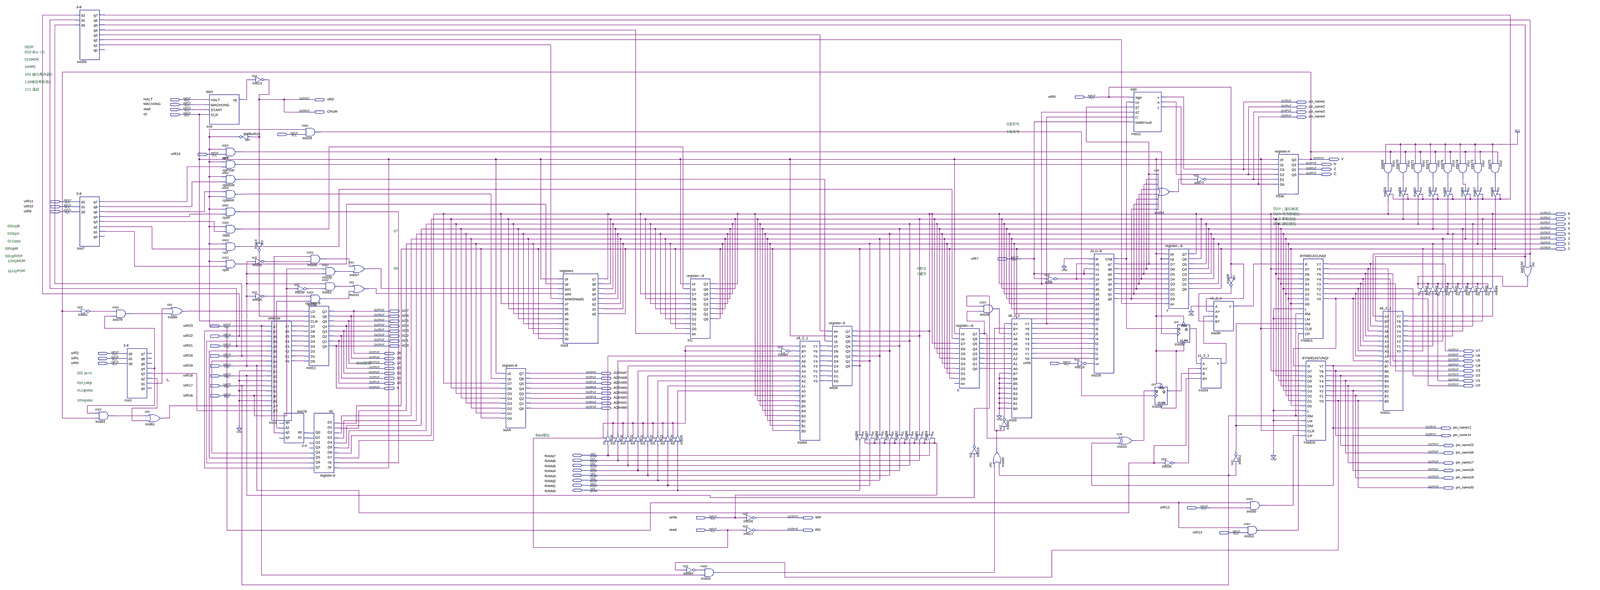
[diagram p0: schematic sheet, whole]
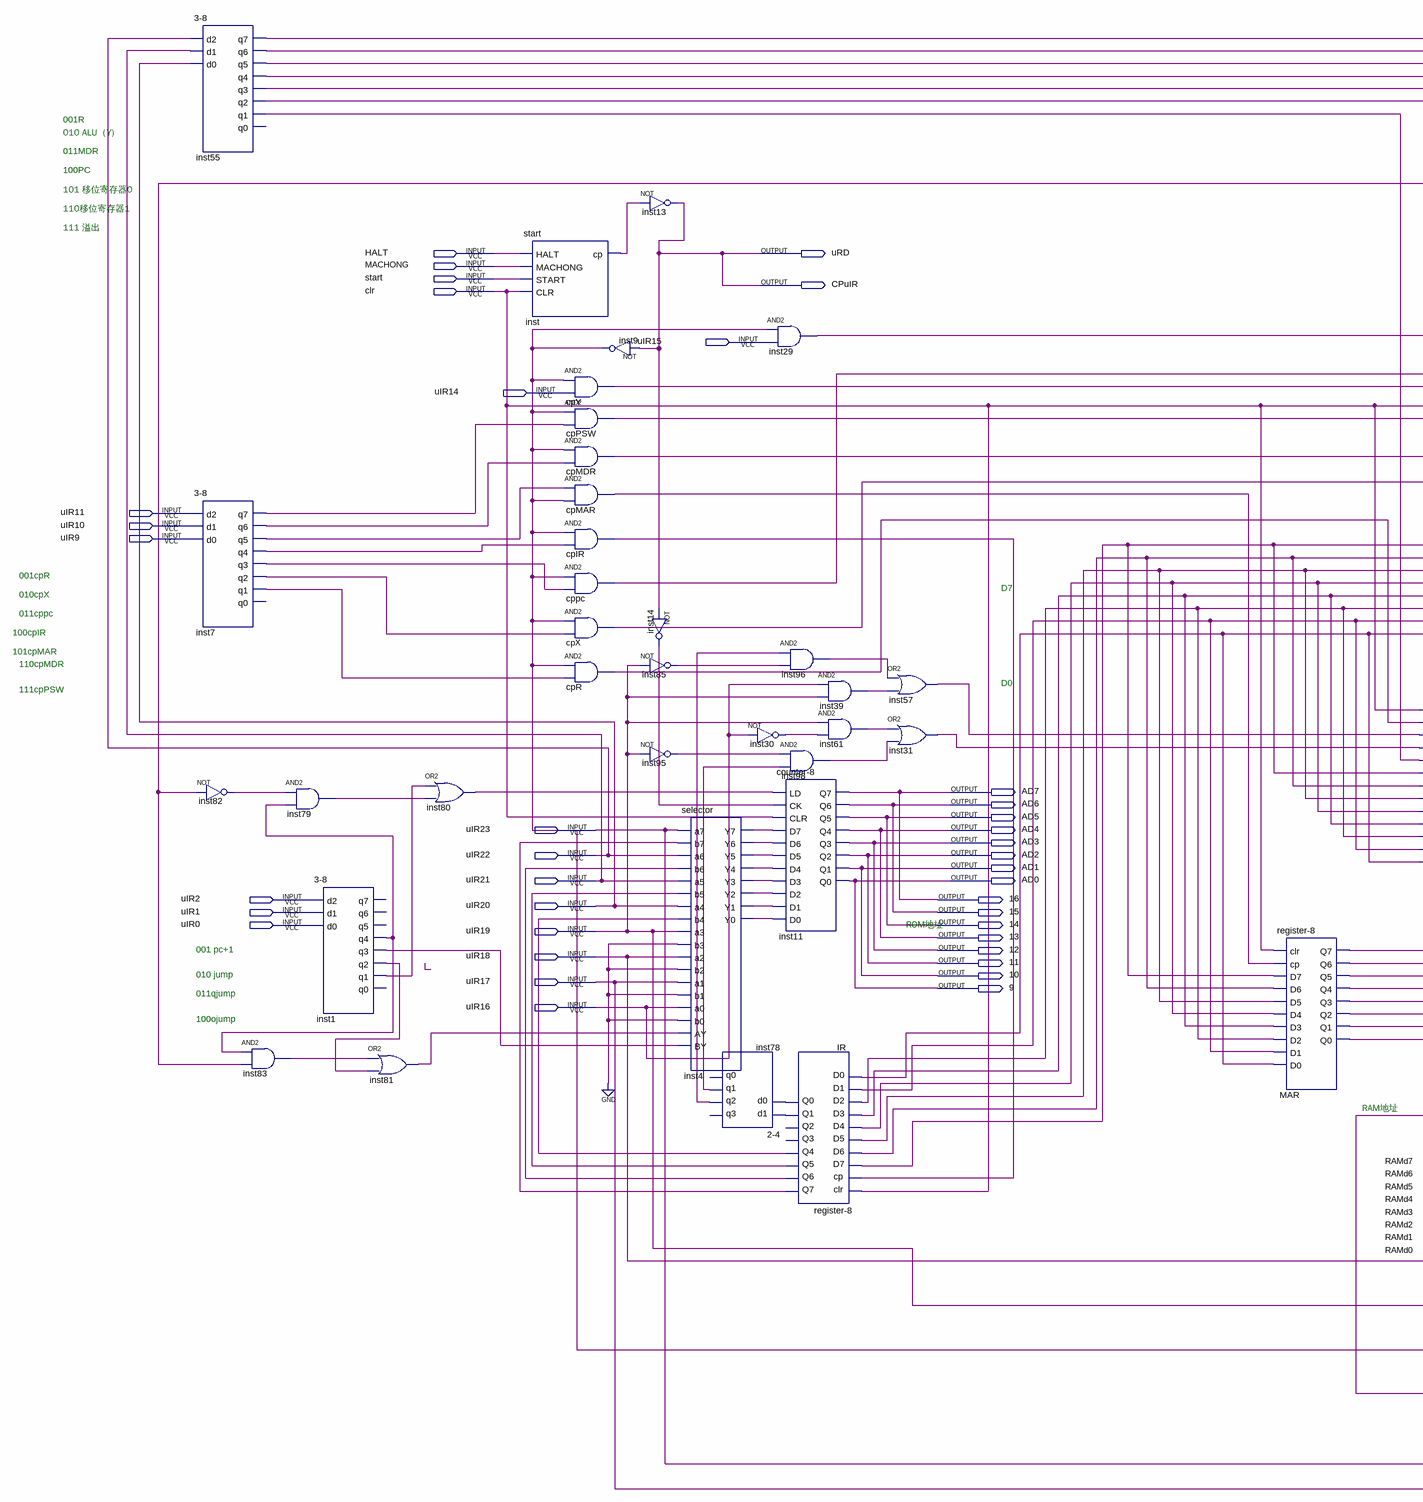
[diagram p1: schematic sheet, left part]
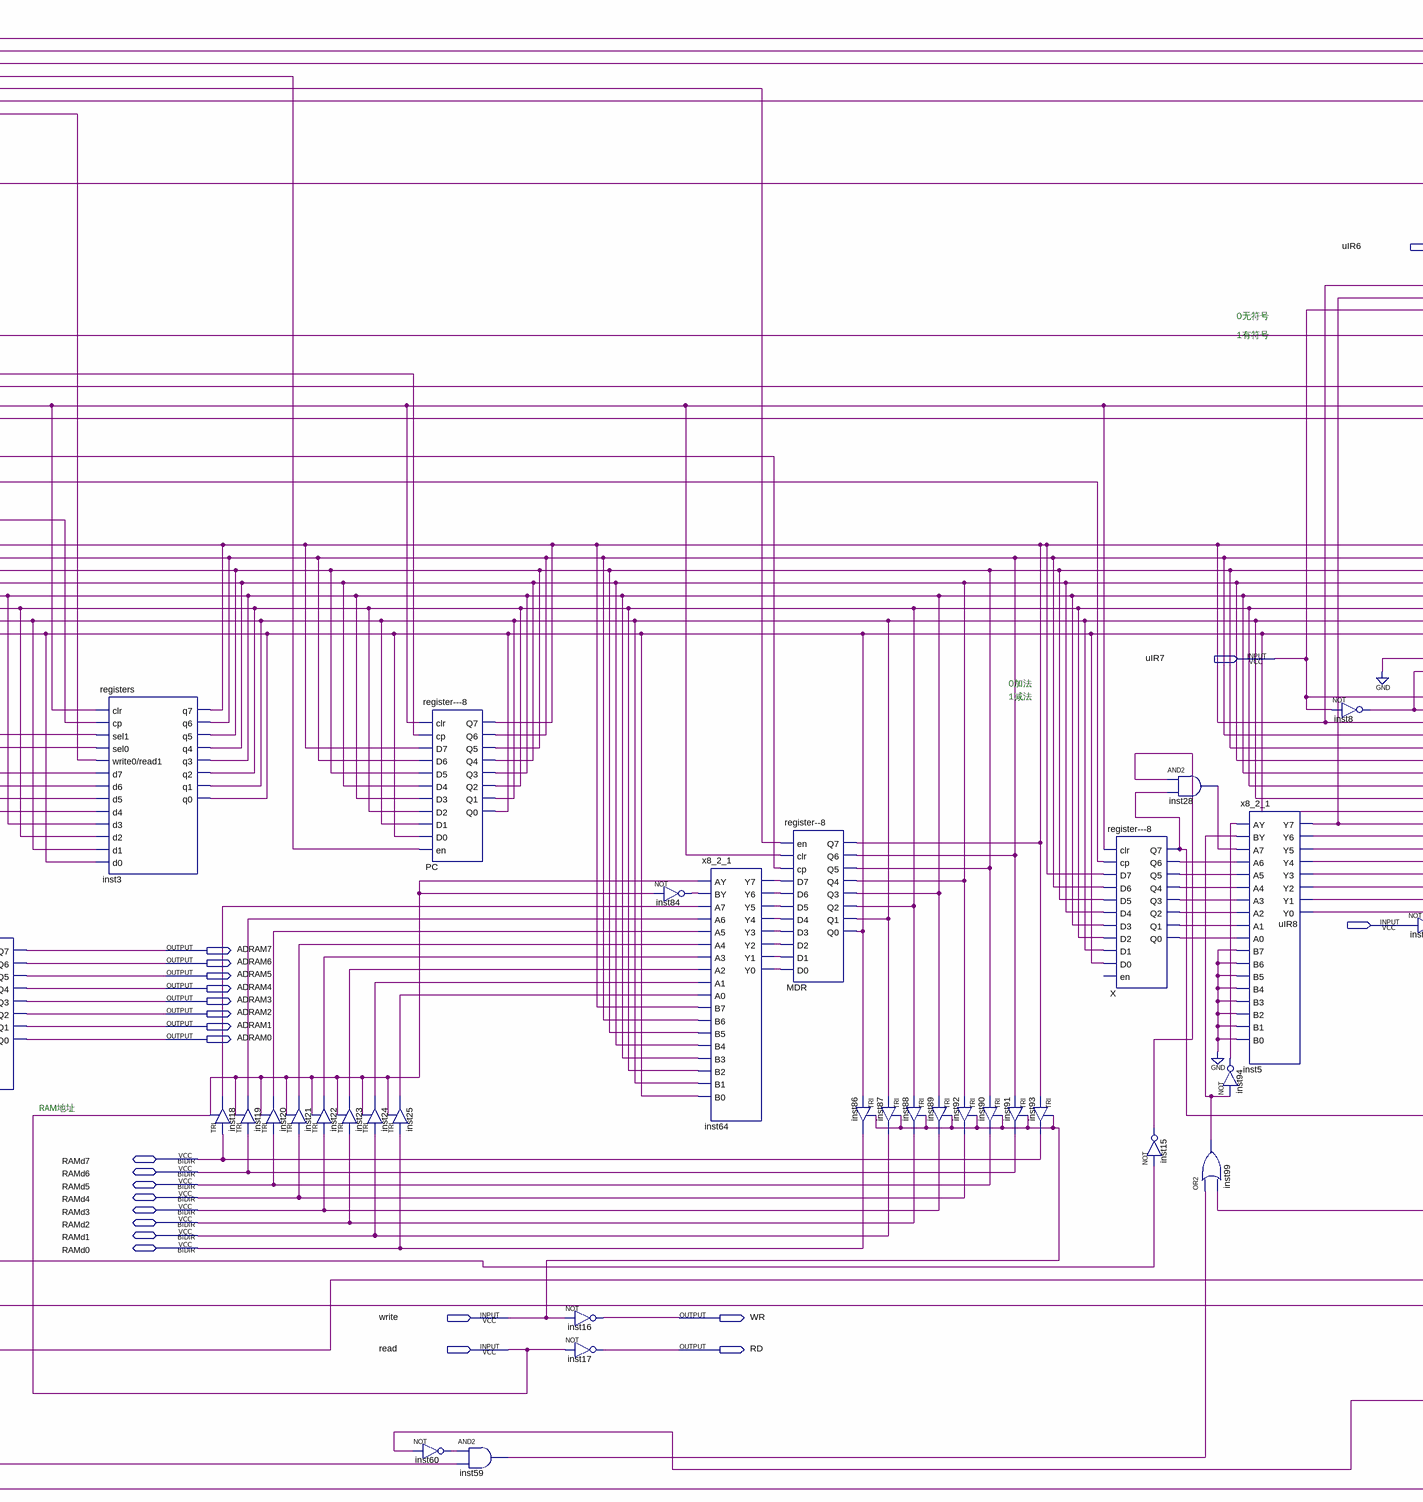
[diagram p2: schematic sheet, centre part]
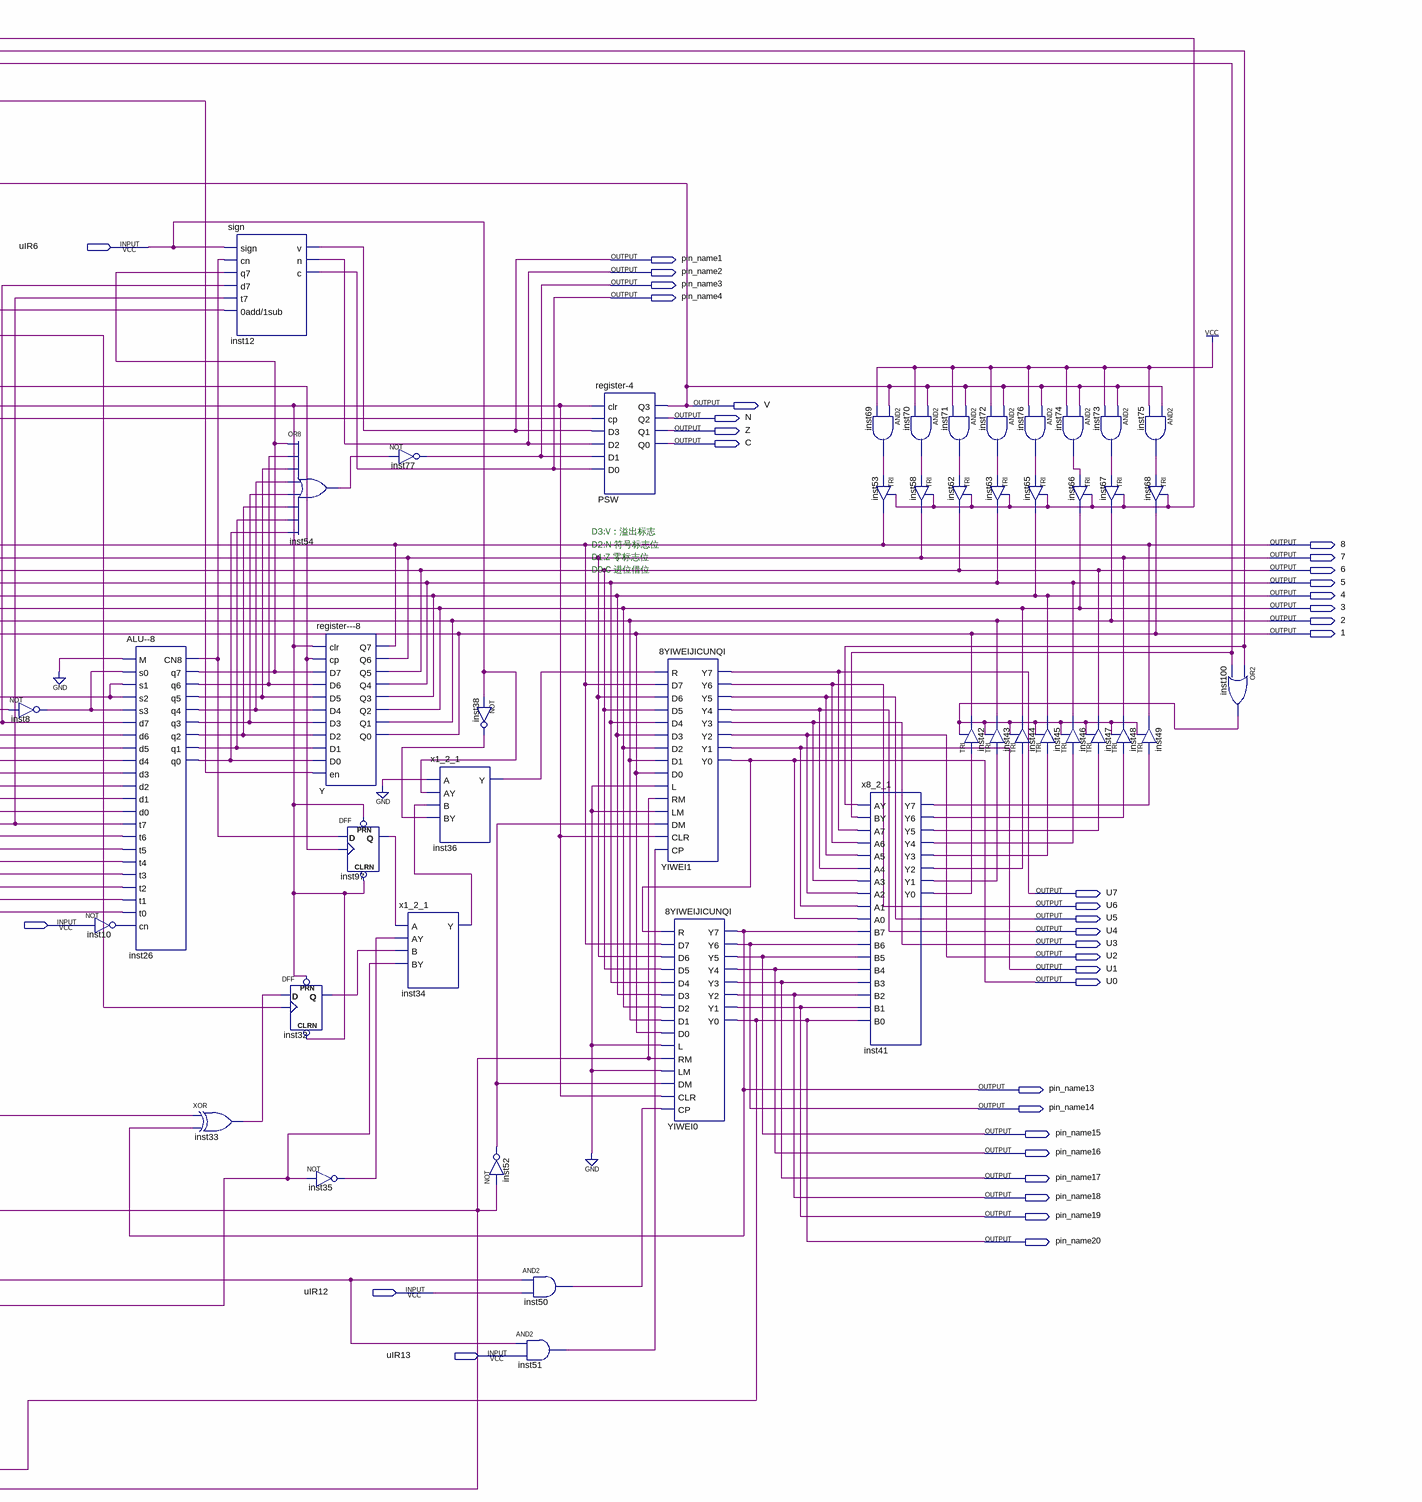
[diagram p3: schematic sheet, right part]
// Quartus schematic complete_machine.bdf as structural Verilog: 112 symbols, 95 pins
module complete_machine (
  input  uIR6,
  input  HALT,
  input  MACHONG,
  input  start,
  input  clr,
  input  uIR15,
  input  uIR14,
  input  uIR11,
  input  uIR10,
  input  uIR9,
  input  uIR7,
  input  uIR23,
  input  uIR22,
  input  uIR21,
  input  uIR2,
  input  uIR20,
  input  uIR1,
  input  uIR0,
  input  uIR8,
  input  uIR19,
  input  uIR18,
  input  uIR17,
  input  uIR16,
  input  uIR12,
  input  write,
  input  read,
  input  uIR13,
  inout  RAMd7,
  inout  RAMd6,
  inout  RAMd5,
  inout  RAMd4,
  inout  RAMd3,
  inout  RAMd2,
  inout  RAMd1,
  inout  RAMd0,
  output uRD,
  output pin_name1,
  output pin_name2,
  output CPuIR,
  output pin_name3,
  output pin_name4,
  output V,
  output N,
  output Z,
  output C,
  output \8 ,
  output \7 ,
  output \6 ,
  output \5 ,
  output \4 ,
  output \3 ,
  output \2 ,
  output \1 ,
  output AD7,
  output AD6,
  output AD5,
  output AD4,
  output AD3,
  output AD2,
  output AD1,
  output AD0,
  output U7,
  output \16 ,
  output U6,
  output \15 ,
  output U5,
  output \14 ,
  output U4,
  output \13 ,
  output U3,
  output \12 ,
  output ADRAM7,
  output U2,
  output \11 ,
  output ADRAM6,
  output U1,
  output \10 ,
  output ADRAM5,
  output U0,
  output \9 ,
  output ADRAM4,
  output ADRAM3,
  output ADRAM2,
  output ADRAM1,
  output ADRAM0,
  output pin_name13,
  output pin_name14,
  output pin_name15,
  output pin_name16,
  output pin_name17,
  output pin_name18,
  output pin_name19,
  output pin_name20,
  output WR,
  output RD
);

  wire cpIR_out, cpMAR_out, cpMDR_out, cppc_out, cpPSW_out, cpR_out, cpX_out, cpY_out, inst1_q1, inst1_q2,
       inst1_q3, inst1_q4, inst4_y0, inst4_y1, inst4_y2, inst4_y3, inst4_y4, inst4_y5, inst4_y6, inst4_y7,
       inst5_y0, inst5_y1, inst5_y2, inst5_y3, inst5_y4, inst5_y5, inst5_y6, inst5_y7, inst7_q1, inst7_q2,
       inst7_q3, inst7_q4, inst7_q5, inst7_q6, inst7_q7, inst8_out, inst9_out, inst10_out, inst14_out,
       inst15_out, inst18_out, inst19_out, inst20_out, inst21_out, inst22_out, inst23_out, inst24_out,
       inst25_out, inst26_cn8, inst26_q0, inst26_q1, inst26_q2, inst26_q3, inst26_q4, inst26_q5, inst26_q6,
       inst26_q7, inst28_out, inst29_out, inst30_out, inst31_out, inst32_q, inst33_out, inst34_y, inst35_out,
       inst36_y, inst38_out, inst39_out, inst41_y0, inst41_y1, inst41_y2, inst41_y3, inst41_y4, inst41_y5,
       inst41_y6, inst41_y7, inst50_out, inst51_out, inst52_out, inst54_out, inst55_q1, inst55_q2, inst55_q3,
       inst55_q4, inst55_q5, inst55_q6, inst55_q7, inst57_out, inst59_out, inst60_out, inst61_out, inst64_y0,
       inst64_y1, inst64_y2, inst64_y3, inst64_y4, inst64_y5, inst64_y6, inst64_y7, inst69_out, inst70_out,
       inst71_out, inst72_out, inst73_out, inst74_out, inst75_out, inst76_out, inst78_q1, inst78_q2,
       inst79_out, inst80_out, inst81_out, inst82_out, inst83_out, inst84_out, inst85_out, inst94_out,
       inst95_out, inst96_out, inst97_q, inst98_out, inst99_out, inst100_out, inst_cp, IR_q0, IR_q1, IR_q4,
       IR_q5, IR_q6, IR_q7, X_q0, X_q1, X_q2, X_q3, X_q4, X_q5, X_q6, X_q7;

  \3-8  inst55 (
    .d2(uIR22), .d1(uIR21), .d0(uIR20), .q7(inst55_q7), .q6(inst55_q6), .q5(inst55_q5), .q4(inst55_q4),
    .q3(inst55_q3), .q2(inst55_q2), .q1(inst55_q1));  // open: q0
  \3-8  inst7 (
    .d2(uIR11), .d1(uIR10), .d0(uIR9), .q7(inst7_q7), .q6(inst7_q6), .q5(inst7_q5), .q4(inst7_q4),
    .q3(inst7_q3), .q2(inst7_q2), .q1(inst7_q1));  // open: q0
  not inst82 (inst82_out, V);
  and inst79 (inst79_out, inst82_out, inst1_q4);
  and inst83 (inst83_out, inst1_q4, V);
  \3-8  inst1 (
    .d2(uIR2), .d1(uIR1), .d0(uIR0), .q4(inst1_q4), .q3(inst1_q3), .q2(inst1_q2), .q1(inst1_q1));  // open: q7, q6, q5, q0
  or inst81 (inst81_out, inst83_out, inst1_q2);
  or inst80 (inst80_out, inst1_q1, inst79_out);
  start inst (.HALT(HALT), .MACHONG(MACHONG), .START(start), .CLR(clr), .cp(inst_cp));
  and cpY (cpY_out, inst9_out, uIR14);
  and cpPSW (cpPSW_out, inst9_out, inst7_q7);
  and cpMDR (cpMDR_out, inst9_out, inst7_q6);
  and cpMAR (cpMAR_out, inst7_q5, inst9_out);
  and cpIR (cpIR_out, inst9_out, inst7_q4);
  and cppc (cppc_out, inst9_out, inst7_q3);
  and cpX (cpX_out, inst9_out, inst7_q2);
  and cpR (cpR_out, inst9_out, inst7_q1);
  not inst13 (CPuIR, inst_cp);
  not inst9 (inst9_out, CPuIR);
  not inst85 (inst85_out, uIR19);
  not inst95 (inst95_out, uIR19);
  not inst14 (inst14_out, CPuIR);
  selector inst4 (
    .a7(uIR23), .b7(IR_q7), .a6(uIR22), .b6(IR_q6), .a5(uIR21), .b5(IR_q5), .a4(uIR20), .b4(IR_q4),
    .a3(uIR19), .b3(1'b0), .a2(uIR18), .b2(1'b0), .a1(uIR17), .b1(1'b0), .a0(uIR16), .b0(1'b0),
    .AY(inst81_out), .BY(inst1_q3), .Y7(inst4_y7), .Y6(inst4_y6), .Y5(inst4_y5), .Y4(inst4_y4),
    .Y3(inst4_y3), .Y2(inst4_y2), .Y1(inst4_y1), .Y0(inst4_y0));
  \2-4  inst78 (.d1(IR_q1), .d0(IR_q0), .q2(inst78_q2), .q1(inst78_q1));  // open: q3, q0
  and inst29 (inst29_out, inst9_out, uIR15);
  and inst96 (inst96_out, inst78_q2, inst85_out);
  not inst30 (inst30_out, uIR16);
  and inst98 (inst98_out, inst95_out, inst78_q1);
  \counter-8  inst11 (
    .LD(inst80_out), .CK(inst14_out), .CLR(clr), .D7(inst4_y7), .D6(inst4_y6), .D5(inst4_y5), .D4(inst4_y4),
    .D3(inst4_y3), .D2(inst4_y2), .D1(inst4_y1), .D0(inst4_y0), .Q7(\16 ), .Q6(\15 ), .Q5(\14 ), .Q4(\13 ),
    .Q3(\12 ), .Q2(\11 ), .Q1(\10 ), .Q0(\9 ));
  \register-8  IR (
    .clr(clr), .cp(cpIR_out), .D7(\8 ), .D6(\7 ), .D5(\6 ), .D4(\5 ), .D3(\4 ), .D2(\3 ), .D1(\2 ), .D0(\1 ),
    .Q7(IR_q7), .Q6(IR_q6), .Q5(IR_q5), .Q4(IR_q4), .Q1(IR_q1), .Q0(IR_q0));  // open: Q3, Q2
  and inst39 (inst39_out, uIR16, uIR19);
  and inst61 (inst61_out, uIR19, inst30_out);
  or inst57 (inst57_out, inst96_out, inst39_out);
  or inst31 (inst31_out, inst61_out, inst98_out);
  \register-8  MAR (
    .clr(clr), .cp(cpMAR_out), .D7(\8 ), .D6(\7 ), .D5(\6 ), .D4(\5 ), .D3(\4 ), .D2(\3 ), .D1(\2 ),
    .D0(\1 ), .Q7(ADRAM7), .Q6(ADRAM6), .Q5(ADRAM5), .Q4(ADRAM4), .Q3(ADRAM3), .Q2(ADRAM2), .Q1(ADRAM1),
    .Q0(ADRAM0));
  registers inst3 (
    .clr(clr), .cp(cpR_out), .sel1(inst57_out), .sel0(inst31_out), .\write0/read1 (inst55_q1), .d7(\8 ),
    .d6(\7 ), .d5(\6 ), .d4(\5 ), .d3(\4 ), .d2(\3 ), .d1(\2 ), .d0(\1 ), .q7(\8 ), .q6(\7 ), .q5(\6 ),
    .q4(\5 ), .q3(\4 ), .q2(\3 ), .q1(\2 ), .q0(\1 ));
  TRI inst18 (.IN(RAMd7), .OE(read), .OUT(inst18_out));
  TRI inst19 (.IN(RAMd6), .OE(read), .OUT(inst19_out));
  TRI inst20 (.IN(RAMd5), .OE(read), .OUT(inst20_out));
  TRI inst21 (.IN(RAMd4), .OE(read), .OUT(inst21_out));
  TRI inst22 (.IN(RAMd3), .OE(read), .OUT(inst22_out));
  TRI inst23 (.IN(RAMd2), .OE(read), .OUT(inst23_out));
  TRI inst24 (.IN(RAMd1), .OE(read), .OUT(inst24_out));
  \register---8  PC (
    .clr(clr), .cp(cppc_out), .D7(\8 ), .D6(\7 ), .D5(\6 ), .D4(\5 ), .D3(\4 ), .D2(\3 ), .D1(\2 ), .D0(\1 ),
    .en(inst55_q4), .Q7(\8 ), .Q6(\7 ), .Q5(\6 ), .Q4(\5 ), .Q3(\4 ), .Q2(\3 ), .Q1(\2 ), .Q0(\1 ));
  TRI inst25 (.IN(RAMd0), .OE(read), .OUT(inst25_out));
  not inst60 (inst60_out, pin_name20);
  and inst59 (inst59_out, inst60_out, uIR23);
  not inst16 (WR, write);
  not inst17 (RD, read);
  not inst84 (inst84_out, read);
  x8_2_1 inst64 (
    .AY(read), .BY(inst84_out), .A7(inst18_out), .A6(inst19_out), .A5(inst20_out), .A4(inst21_out),
    .A3(inst22_out), .A2(inst23_out), .A1(inst24_out), .A0(inst25_out), .B7(\8 ), .B6(\7 ), .B5(\6 ),
    .B4(\5 ), .B3(\4 ), .B2(\3 ), .B1(\2 ), .B0(\1 ), .Y7(inst64_y7), .Y6(inst64_y6), .Y5(inst64_y5),
    .Y4(inst64_y4), .Y3(inst64_y3), .Y2(inst64_y2), .Y1(inst64_y1), .Y0(inst64_y0));
  \register--8  MDR (
    .en(inst55_q3), .clr(clr), .cp(cpMDR_out), .D7(inst64_y7), .D6(inst64_y6), .D5(inst64_y5),
    .D4(inst64_y4), .D3(inst64_y3), .D2(inst64_y2), .D1(inst64_y1), .D0(inst64_y0), .Q7(\8 ), .Q6(\7 ),
    .Q5(\6 ), .Q4(\5 ), .Q3(\4 ), .Q2(\3 ), .Q1(\2 ), .Q0(\1 ));
  TRI inst86 (.IN(\1 ), .OE(write), .OUT(RAMd0));
  TRI inst87 (.IN(\2 ), .OE(write), .OUT(RAMd1));
  TRI inst88 (.IN(\3 ), .OE(write), .OUT(RAMd2));
  TRI inst89 (.IN(\4 ), .OE(write), .OUT(RAMd3));
  TRI inst90 (.IN(\6 ), .OE(write), .OUT(RAMd5));
  TRI inst92 (.IN(\5 ), .OE(write), .OUT(RAMd4));
  TRI inst91 (.IN(\7 ), .OE(write), .OUT(RAMd6));
  TRI inst93 (.IN(\8 ), .OE(write), .OUT(RAMd7));
  \register---8  X (
    .clr(clr), .cp(cpX_out), .D7(\8 ), .D6(\7 ), .D5(\6 ), .D4(\5 ), .D3(\4 ), .D2(\3 ), .D1(\2 ), .D0(\1 ),
    .Q7(X_q7), .Q6(X_q6), .Q5(X_q5), .Q4(X_q4), .Q3(X_q3), .Q2(X_q2), .Q1(X_q1), .Q0(X_q0));  // open: en
  not inst15 (inst15_out, uIR18);
  and inst28 (inst28_out, inst15_out, X_q7);
  or inst99 (inst99_out, inst59_out, uIR17);
  x8_2_1 inst5 (
    .AY(inst94_out), .BY(inst99_out), .A7(inst28_out), .A6(X_q6), .A5(X_q5), .A4(X_q4), .A3(X_q3), .A2(X_q2),
    .A1(X_q1), .A0(X_q0), .B7(1'b0), .B6(1'b0), .B5(1'b0), .B4(1'b0), .B3(1'b0), .B2(1'b0), .B1(1'b0),
    .B0(1'b0), .Y7(inst5_y7), .Y6(inst5_y6), .Y5(inst5_y5), .Y4(inst5_y4), .Y3(inst5_y3), .Y2(inst5_y2),
    .Y1(inst5_y1), .Y0(inst5_y0));
  not inst94 (inst94_out, inst99_out);
  not inst8 (inst8_out, uIR7);
  \ALU--8  inst26 (
    .M(1'b0), .s0(inst8_out), .s1(uIR7), .s2(uIR7), .s3(inst8_out), .d7(\8 ), .d6(\7 ), .d5(\6 ), .d4(\5 ),
    .d3(\4 ), .d2(\3 ), .d1(\2 ), .d0(\1 ), .t7(inst5_y7), .t6(inst5_y6), .t5(inst5_y5), .t4(inst5_y4),
    .t3(inst5_y3), .t2(inst5_y2), .t1(inst5_y1), .t0(inst5_y0), .cn(inst10_out), .CN8(inst26_cn8),
    .q7(inst26_q7), .q6(inst26_q6), .q5(inst26_q5), .q4(inst26_q4), .q3(inst26_q3), .q2(inst26_q2),
    .q1(inst26_q1), .q0(inst26_q0));
  not inst10 (inst10_out, uIR8);
  sign inst12 (
    .sign(uIR6), .cn(inst26_cn8), .q7(inst26_q7), .d7(\8 ), .t7(inst5_y7), .\0add/1sub (uIR7), .v(pin_name1),
    .n(pin_name2), .c(pin_name4));
  xor inst33 (inst33_out, X_q7, pin_name13);
  or inst54 (inst54_out, inst26_q7, inst26_q6, inst26_q5, inst26_q4, inst26_q3, inst26_q2, inst26_q1, inst26_q0);
  \register---8  Y (
    .clr(clr), .cp(cpY_out), .D7(inst26_q7), .D6(inst26_q6), .D5(inst26_q5), .D4(inst26_q4), .D3(inst26_q3),
    .D2(inst26_q2), .D1(inst26_q1), .D0(inst26_q0), .en(inst55_q2), .Q7(\8 ), .Q6(\7 ), .Q5(\6 ), .Q4(\5 ),
    .Q3(\4 ), .Q2(\3 ), .Q1(\2 ), .Q0(\1 ));
  DFF inst32 (.CLRN(clr), .CLK(inst29_out), .D(inst33_out), .PRN(clr), .Q(inst32_q));
  not inst35 (inst35_out, uIR19);
  DFF inst97 (.CLRN(clr), .CLK(cpY_out), .D(inst26_cn8), .PRN(clr), .Q(inst97_q));
  not inst77 (pin_name3, inst54_out);
  x1_2_1 inst36 (.A(1'b0), .AY(uIR6), .B(inst34_y), .BY(inst38_out), .Y(inst36_y));
  x1_2_1 inst34 (.A(inst97_q), .AY(inst35_out), .B(inst32_q), .BY(uIR19), .Y(inst34_y));
  not inst38 (inst38_out, uIR6);
  not inst52 (inst52_out, uIR17);
  and inst50 (inst50_out, inst9_out, uIR12);
  and inst51 (inst51_out, inst9_out, uIR13);
  \register-4  PSW (
    .clr(clr), .cp(cpPSW_out), .D3(pin_name1), .D2(pin_name2), .D1(pin_name3), .D0(pin_name4), .Q3(V),
    .Q2(N), .Q1(Z), .Q0(C));
  \8YIWEIJICUNQI  YIWEI1 (
    .R(inst36_y), .D7(\8 ), .D6(\7 ), .D5(\6 ), .D4(\5 ), .D3(\4 ), .D2(\3 ), .D1(\2 ), .D0(\1 ), .L(1'b0),
    .RM(uIR17), .LM(1'b0), .DM(inst52_out), .CLR(clr), .CP(inst51_out), .Y7(U7), .Y6(U6), .Y5(U5), .Y4(U4),
    .Y3(U3), .Y2(U2), .Y1(U1), .Y0(U0));
  \8YIWEIJICUNQI  YIWEI0 (
    .R(U0), .D7(\8 ), .D6(\7 ), .D5(\6 ), .D4(\5 ), .D3(\4 ), .D2(\3 ), .D1(\2 ), .D0(\1 ), .L(1'b0),
    .RM(uIR17), .LM(1'b0), .DM(inst52_out), .CLR(clr), .CP(inst50_out), .Y7(pin_name13), .Y6(pin_name14),
    .Y5(pin_name15), .Y4(pin_name16), .Y3(pin_name17), .Y2(pin_name18), .Y1(pin_name19), .Y0(pin_name20));
  and inst69 (inst69_out, V, 1'b1);
  TRI inst53 (.IN(inst69_out), .OE(inst55_q7), .OUT(\8 ));
  x8_2_1 inst41 (
    .AY(inst55_q6), .BY(inst55_q5), .A7(U7), .A6(U6), .A5(U5), .A4(U4), .A3(U3), .A2(U2), .A1(U1), .A0(U0),
    .B7(pin_name13), .B6(pin_name14), .B5(pin_name15), .B4(pin_name16), .B3(pin_name17), .B2(pin_name18),
    .B1(pin_name19), .B0(pin_name20), .Y7(inst41_y7), .Y6(inst41_y6), .Y5(inst41_y5), .Y4(inst41_y4),
    .Y3(inst41_y3), .Y2(inst41_y2), .Y1(inst41_y1), .Y0(inst41_y0));
  and inst70 (inst70_out, V, 1'b1);
  TRI inst58 (.IN(inst70_out), .OE(inst55_q7), .OUT(\7 ));
  and inst71 (inst71_out, V, 1'b1);
  and inst72 (inst72_out, V, 1'b1);
  TRI inst62 (.IN(inst71_out), .OE(inst55_q7), .OUT(\6 ));
  TRI inst63 (.IN(inst72_out), .OE(inst55_q7), .OUT(\5 ));
  TRI inst42 (.IN(inst41_y0), .OE(inst100_out), .OUT(\1 ));
  TRI inst43 (.IN(inst41_y1), .OE(inst100_out), .OUT(\2 ));
  and inst76 (inst76_out, V, 1'b1);
  TRI inst65 (.IN(inst76_out), .OE(inst55_q7), .OUT(\4 ));
  TRI inst44 (.IN(inst41_y2), .OE(inst100_out), .OUT(\3 ));
  TRI inst45 (.IN(inst41_y3), .OE(inst100_out), .OUT(\4 ));
  and inst74 (inst74_out, V, 1'b1);
  TRI inst66 (.IN(inst74_out), .OE(inst55_q7), .OUT(\3 ));
  TRI inst46 (.IN(inst41_y4), .OE(inst100_out), .OUT(\5 ));
  TRI inst47 (.IN(inst41_y5), .OE(inst100_out), .OUT(\6 ));
  and inst73 (inst73_out, V, 1'b1);
  and inst75 (inst75_out, V, 1'b1);
  TRI inst67 (.IN(inst73_out), .OE(inst55_q7), .OUT(\2 ));
  TRI inst48 (.IN(inst41_y6), .OE(inst100_out), .OUT(\7 ));
  TRI inst49 (.IN(inst41_y7), .OE(inst100_out), .OUT(\8 ));
  TRI inst68 (.IN(inst75_out), .OE(inst55_q7), .OUT(\1 ));
  or inst100 (inst100_out, inst55_q6, inst55_q5);

  assign AD0 = \9 ;
  assign AD1 = \10 ;
  assign AD2 = \11 ;
  assign AD3 = \12 ;
  assign AD4 = \13 ;
  assign AD5 = \14 ;
  assign AD6 = \15 ;
  assign AD7 = \16 ;
  assign uRD = CPuIR;

  // Notes on the sheet:
  //   001R
  //   010 ALU（Y)
  //   011MDR
  //   100PC
  //   101 移位寄存器0
  //   110移位寄存器1
  //   111 溢出
  //   0无符号
  //   1有符号
  //   D3:V：溢出标志
  //   D2:N 符号标志位
  //   D1:Z 零标志位
  //   D0:C 进位借位
  //   001cpR
  //   D7
  //   010cpX
  //   011cppc
  //   100cpIR
  //   101cpMAR
  //   110cpMDR
  //   D0
  //   0加法
  //   111cpPSW
  //   1减法
  //   ROM地址
  //   001 pc+1
  //   010 jump
  //   011qjump
  //   100ojump
  //   RAM地址
endmodule
